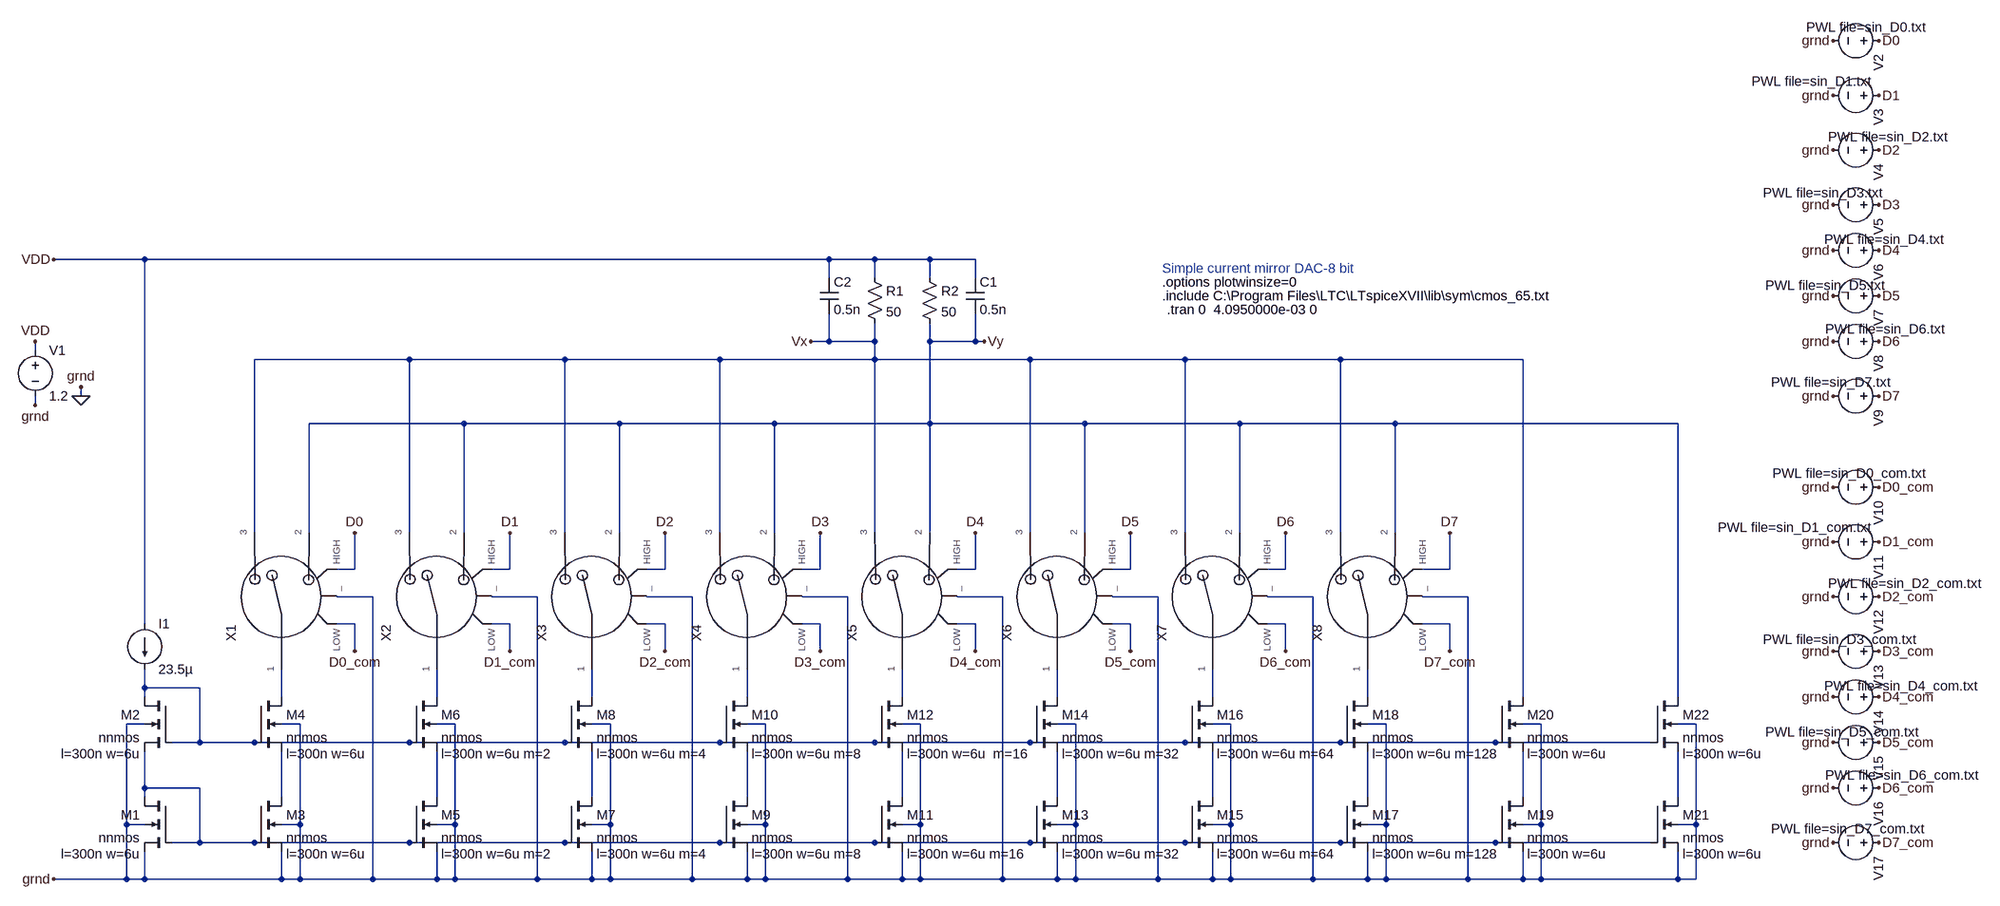
[diagram p0: schematic dac_simple.asc]
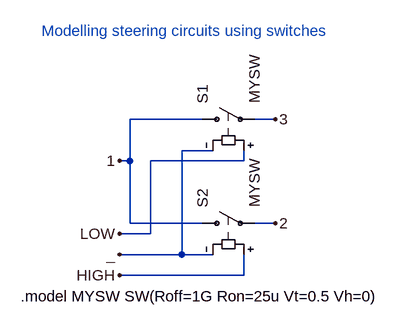
[diagram p1: sub-circuit myspdt.asc]
dac_simple.asc, the LTspice schematic file:
Version 4
SHEET 1 2736 888
WIRE -688 -304 -848 -304
WIRE 512 -304 -688 -304
WIRE 592 -304 512 -304
WIRE 688 -304 592 -304
WIRE 768 -304 688 -304
WIRE 512 -272 512 -304
WIRE 592 -272 592 -304
WIRE 688 -272 688 -304
WIRE 768 -272 768 -304
WIRE 512 -160 512 -208
WIRE 512 -160 480 -160
WIRE 592 -160 592 -192
WIRE 592 -160 512 -160
WIRE 688 -160 688 -192
WIRE 768 -160 768 -208
WIRE 768 -160 688 -160
WIRE 784 -160 768 -160
WIRE -880 -144 -880 -160
WIRE -224 -128 -496 -128
WIRE 48 -128 -224 -128
WIRE 320 -128 48 -128
WIRE 592 -128 592 -160
WIRE 592 -128 320 -128
WIRE 864 -128 592 -128
WIRE 1136 -128 864 -128
WIRE 1408 -128 1136 -128
WIRE 1728 -128 1408 -128
WIRE -800 -64 -800 -80
WIRE -880 -48 -880 -64
WIRE -128 -16 -400 -16
WIRE 144 -16 -128 -16
WIRE 416 -16 144 -16
WIRE 688 -16 688 -160
WIRE 688 -16 416 -16
WIRE 960 -16 688 -16
WIRE 1232 -16 960 -16
WIRE 1504 -16 1232 -16
WIRE 2000 -16 1504 -16
WIRE -496 176 -496 -128
WIRE -400 176 -400 -16
WIRE -224 176 -224 -128
WIRE -128 176 -128 -16
WIRE 48 176 48 -128
WIRE 144 176 144 -16
WIRE 320 176 320 -128
WIRE 416 176 416 -16
WIRE 592 176 592 -128
WIRE 688 176 688 -16
WIRE 864 176 864 -128
WIRE 960 176 960 -16
WIRE 1136 176 1136 -128
WIRE 1232 176 1232 -16
WIRE 1408 176 1408 -128
WIRE 1504 176 1504 -16
WIRE -320 240 -320 176
WIRE -320 240 -352 240
WIRE -48 240 -48 176
WIRE -48 240 -80 240
WIRE 224 240 224 176
WIRE 224 240 192 240
WIRE 496 240 496 176
WIRE 496 240 464 240
WIRE 768 240 768 176
WIRE 768 240 736 240
WIRE 1040 240 1040 176
WIRE 1040 240 1008 240
WIRE 1312 240 1312 176
WIRE 1312 240 1280 240
WIRE 1600 240 1600 176
WIRE 1600 240 1552 240
WIRE -288 288 -352 288
WIRE 0 288 -80 288
WIRE 272 288 192 288
WIRE 544 288 464 288
WIRE 816 288 736 288
WIRE 1088 288 1008 288
WIRE 1360 288 1280 288
WIRE 1632 288 1552 288
WIRE -688 336 -688 -304
WIRE -320 336 -352 336
WIRE -48 336 -80 336
WIRE 224 336 192 336
WIRE 496 336 464 336
WIRE 768 336 736 336
WIRE 1040 336 1008 336
WIRE 1312 336 1280 336
WIRE 1600 336 1552 336
WIRE -320 384 -320 336
WIRE -48 384 -48 336
WIRE 224 384 224 336
WIRE 496 384 496 336
WIRE 768 384 768 336
WIRE 1040 384 1040 336
WIRE 1312 384 1312 336
WIRE 1600 384 1600 336
WIRE -688 448 -688 416
WIRE -592 448 -688 448
WIRE -688 464 -688 448
WIRE -448 464 -448 416
WIRE -176 464 -176 416
WIRE 96 464 96 416
WIRE 368 464 368 416
WIRE 640 464 640 416
WIRE 912 464 912 416
WIRE 1184 464 1184 416
WIRE 1456 464 1456 416
WIRE 1728 464 1728 -128
WIRE 2000 464 2000 -16
WIRE -688 512 -720 512
WIRE -416 512 -448 512
WIRE -144 512 -176 512
WIRE 128 512 96 512
WIRE 400 512 368 512
WIRE 672 512 640 512
WIRE 944 512 912 512
WIRE 1216 512 1184 512
WIRE 1488 512 1456 512
WIRE 1760 512 1728 512
WIRE 2032 512 2000 512
WIRE -592 544 -592 448
WIRE -592 544 -640 544
WIRE -496 544 -592 544
WIRE -224 544 -496 544
WIRE 48 544 -224 544
WIRE 320 544 48 544
WIRE 592 544 320 544
WIRE 864 544 592 544
WIRE 1136 544 864 544
WIRE 1408 544 1136 544
WIRE 1680 544 1408 544
WIRE 1952 544 1680 544
WIRE -688 624 -688 560
WIRE -592 624 -688 624
WIRE -688 640 -688 624
WIRE -448 640 -448 560
WIRE -176 640 -176 560
WIRE 96 640 96 560
WIRE 368 640 368 560
WIRE 640 640 640 560
WIRE 912 640 912 560
WIRE 1184 640 1184 560
WIRE 1456 640 1456 560
WIRE 1728 640 1728 560
WIRE 2000 640 2000 560
WIRE -720 688 -720 512
WIRE -688 688 -720 688
WIRE -416 688 -416 512
WIRE -416 688 -448 688
WIRE -144 688 -144 512
WIRE -144 688 -176 688
WIRE 128 688 128 512
WIRE 128 688 96 688
WIRE 400 688 400 512
WIRE 400 688 368 688
WIRE 672 688 672 512
WIRE 672 688 640 688
WIRE 944 688 944 512
WIRE 944 688 912 688
WIRE 1216 688 1216 512
WIRE 1216 688 1184 688
WIRE 1488 688 1488 512
WIRE 1488 688 1456 688
WIRE 1760 688 1760 512
WIRE 1760 688 1728 688
WIRE 2032 688 2032 512
WIRE 2032 688 2000 688
WIRE -592 720 -592 624
WIRE -592 720 -640 720
WIRE -496 720 -592 720
WIRE -224 720 -496 720
WIRE 48 720 -224 720
WIRE 320 720 48 720
WIRE 592 720 320 720
WIRE 864 720 592 720
WIRE 1136 720 864 720
WIRE 1408 720 1136 720
WIRE 1680 720 1408 720
WIRE 1952 720 1680 720
WIRE -720 784 -720 688
WIRE -720 784 -848 784
WIRE -688 784 -688 736
WIRE -688 784 -720 784
WIRE -448 784 -448 736
WIRE -448 784 -688 784
WIRE -416 784 -416 688
WIRE -416 784 -448 784
WIRE -288 784 -288 288
WIRE -288 784 -416 784
WIRE -176 784 -176 736
WIRE -176 784 -288 784
WIRE -144 784 -144 688
WIRE -144 784 -176 784
WIRE 0 784 0 288
WIRE 0 784 -144 784
WIRE 96 784 96 736
WIRE 96 784 0 784
WIRE 128 784 128 688
WIRE 128 784 96 784
WIRE 272 784 272 288
WIRE 272 784 128 784
WIRE 368 784 368 736
WIRE 368 784 272 784
WIRE 400 784 400 688
WIRE 400 784 368 784
WIRE 544 784 544 288
WIRE 544 784 400 784
WIRE 640 784 640 736
WIRE 640 784 544 784
WIRE 672 784 672 688
WIRE 672 784 640 784
WIRE 816 784 816 288
WIRE 816 784 672 784
WIRE 912 784 912 736
WIRE 912 784 816 784
WIRE 944 784 944 688
WIRE 944 784 912 784
WIRE 1088 784 1088 288
WIRE 1088 784 944 784
WIRE 1184 784 1184 736
WIRE 1184 784 1088 784
WIRE 1216 784 1216 688
WIRE 1216 784 1184 784
WIRE 1360 784 1360 288
WIRE 1360 784 1216 784
WIRE 1456 784 1456 736
WIRE 1456 784 1360 784
WIRE 1488 784 1488 688
WIRE 1488 784 1456 784
WIRE 1632 784 1632 288
WIRE 1632 784 1488 784
WIRE 1728 784 1728 736
WIRE 1728 784 1632 784
WIRE 1760 784 1760 688
WIRE 1760 784 1728 784
WIRE 2000 784 2000 736
WIRE 2000 784 1760 784
WIRE 2032 784 2032 688
WIRE 2032 784 2000 784
FLAG -800 -64 0
FLAG -800 -80 grnd
FLAG -880 -48 grnd
FLAG -880 -160 VDD
FLAG -848 784 grnd
FLAG -848 -304 VDD
FLAG 2272 -688 grnd
FLAG 2272 -592 grnd
FLAG 2272 -496 grnd
FLAG 2272 -400 grnd
FLAG 2272 -320 grnd
FLAG 2272 -240 grnd
FLAG 2272 -160 grnd
FLAG 2272 -64 grnd
FLAG 2352 -688 D0
FLAG 2352 -592 D1
FLAG 2352 -496 D2
FLAG 2352 -400 D3
FLAG 2352 -320 D4
FLAG 2352 -240 D5
FLAG 2352 -160 D6
FLAG 2352 -64 D7
FLAG 2272 96 grnd
FLAG 2272 192 grnd
FLAG 2272 288 grnd
FLAG 2272 384 grnd
FLAG 2272 464 grnd
FLAG 2272 544 grnd
FLAG 2272 624 grnd
FLAG 2272 720 grnd
FLAG 2352 96 D0_com
FLAG 2352 192 D1_com
FLAG 2352 288 D2_com
FLAG 2352 384 D3_com
FLAG 2352 464 D4_com
FLAG 2352 544 D5_com
FLAG 2352 624 D6_com
FLAG 2352 720 D7_com
FLAG 480 -160 Vx
FLAG 784 -160 Vy
FLAG -320 176 D0
FLAG -48 176 D1
FLAG 224 176 D2
FLAG 496 176 D3
FLAG 1040 176 D5
FLAG 768 176 D4
FLAG 1312 176 D6
FLAG 1600 176 D7
FLAG -320 384 D0_com
FLAG -48 384 D1_com
FLAG 224 384 D2_com
FLAG 496 384 D3_com
FLAG 768 384 D4_com
FLAG 1040 384 D5_com
FLAG 1312 384 D6_com
FLAG 1600 384 D7_com
DATAFLAG -176 448 ""
DATAFLAG -176 608 ""
DATAFLAG -448 608 ""
DATAFLAG -448 448 ""
DATAFLAG 368 448 ""
DATAFLAG 368 624 ""
SYMBOL nmos4 -640 640 M0
WINDOW 123 56 100 Left 2
SYMATTR Value2 l=300n w=6u
SYMATTR InstName M1
SYMATTR Value nnmos
SYMBOL nmos4 -640 464 M0
WINDOW 123 56 100 Left 2
SYMATTR Value2 l=300n w=6u
SYMATTR InstName M2
SYMATTR Value nnmos
SYMBOL current -688 336 R0
WINDOW 123 0 0 Left 0
WINDOW 39 0 0 Left 0
SYMATTR InstName I1
SYMATTR Value 23.5µ
SYMBOL voltage -880 -160 R0
WINDOW 123 0 0 Left 0
WINDOW 39 0 0 Left 0
SYMATTR InstName V1
SYMATTR Value 1.2
SYMBOL voltage 2368 -688 R90
WINDOW 3 -24 -68 VRight 2
WINDOW 123 0 0 Left 0
WINDOW 39 0 0 Left 0
SYMATTR Value PWL file=sin_D0.txt
SYMATTR InstName V2
SYMBOL voltage 2368 -592 R90
WINDOW 3 -25 28 VRight 2
WINDOW 123 0 0 Left 0
WINDOW 39 0 0 Left 0
SYMATTR Value PWL file=sin_D1.txt
SYMATTR InstName V3
SYMBOL voltage 2368 -496 R90
WINDOW 3 -23 105 VLeft 2
WINDOW 123 0 0 Left 0
WINDOW 39 0 0 Left 0
SYMATTR Value PWL file=sin_D2.txt
SYMATTR InstName V4
SYMBOL voltage 2368 -400 R90
WINDOW 3 -21 219 VLeft 2
WINDOW 123 0 0 Left 0
WINDOW 39 0 0 Left 0
SYMATTR Value PWL file=sin_D3.txt
SYMATTR InstName V5
SYMBOL voltage 2368 -320 R90
WINDOW 3 -19 111 VLeft 2
WINDOW 123 0 0 Left 0
WINDOW 39 0 0 Left 0
SYMATTR Value PWL file=sin_D4.txt
SYMATTR InstName V6
SYMBOL voltage 2368 -240 R90
WINDOW 3 -18 215 VLeft 2
WINDOW 123 0 0 Left 0
WINDOW 39 0 0 Left 0
SYMATTR Value PWL file=sin_D5.txt
SYMATTR InstName V7
SYMBOL voltage 2368 -160 R90
WINDOW 3 -22 110 VLeft 2
WINDOW 123 0 0 Left 0
WINDOW 39 0 0 Left 0
SYMATTR Value PWL file=sin_D6.txt
SYMATTR InstName V8
SYMBOL voltage 2368 -64 R90
WINDOW 3 -24 205 VLeft 2
WINDOW 123 0 0 Left 0
WINDOW 39 0 0 Left 0
SYMATTR Value PWL file=sin_D7.txt
SYMATTR InstName V9
SYMBOL voltage 2368 96 R90
WINDOW 3 -24 -68 VRight 2
WINDOW 123 0 0 Left 0
WINDOW 39 0 0 Left 0
SYMATTR Value PWL file=sin_D0_com.txt
SYMATTR InstName V10
SYMBOL voltage 2368 192 R90
WINDOW 3 -25 28 VRight 2
WINDOW 123 0 0 Left 0
WINDOW 39 0 0 Left 0
SYMATTR Value PWL file=sin_D1_com.txt
SYMATTR InstName V11
SYMBOL voltage 2368 288 R90
WINDOW 3 -23 105 VLeft 2
WINDOW 123 0 0 Left 0
WINDOW 39 0 0 Left 0
SYMATTR Value PWL file=sin_D2_com.txt
SYMATTR InstName V12
SYMBOL voltage 2368 384 R90
WINDOW 3 -21 219 VLeft 2
WINDOW 123 0 0 Left 0
WINDOW 39 0 0 Left 0
SYMATTR Value PWL file=sin_D3_com.txt
SYMATTR InstName V13
SYMBOL voltage 2368 464 R90
WINDOW 3 -19 111 VLeft 2
WINDOW 123 0 0 Left 0
WINDOW 39 0 0 Left 0
SYMATTR Value PWL file=sin_D4_com.txt
SYMATTR InstName V14
SYMBOL voltage 2368 544 R90
WINDOW 3 -18 215 VLeft 2
WINDOW 123 0 0 Left 0
WINDOW 39 0 0 Left 0
SYMATTR Value PWL file=sin_D5_com.txt
SYMATTR InstName V15
SYMBOL voltage 2368 624 R90
WINDOW 3 -22 110 VLeft 2
WINDOW 123 0 0 Left 0
WINDOW 39 0 0 Left 0
SYMATTR Value PWL file=sin_D6_com.txt
SYMATTR InstName V16
SYMBOL voltage 2368 720 R90
WINDOW 3 -24 205 VLeft 2
WINDOW 123 0 0 Left 0
WINDOW 39 0 0 Left 0
SYMATTR Value PWL file=sin_D7_com.txt
SYMATTR InstName V17
SYMBOL nmos4 -496 640 R0
WINDOW 123 56 100 Left 2
SYMATTR Value2 l=300n w=6u
SYMATTR InstName M3
SYMATTR Value nnmos
SYMBOL nmos4 -496 464 R0
WINDOW 123 56 100 Left 2
SYMATTR Value2 l=300n w=6u
SYMATTR InstName M4
SYMATTR Value nnmos
SYMBOL nmos4 -224 640 R0
WINDOW 123 56 100 Left 2
SYMATTR Value2 l=300n w=6u m=2
SYMATTR InstName M5
SYMATTR Value nnmos
SYMBOL nmos4 -224 464 R0
WINDOW 123 56 100 Left 2
SYMATTR Value2 l=300n w=6u m=2
SYMATTR InstName M6
SYMATTR Value nnmos
SYMBOL nmos4 48 640 R0
WINDOW 123 56 100 Left 2
SYMATTR Value2 l=300n w=6u m=4
SYMATTR InstName M7
SYMATTR Value nnmos
SYMBOL nmos4 48 464 R0
WINDOW 123 56 100 Left 2
SYMATTR Value2 l=300n w=6u m=4
SYMATTR InstName M8
SYMATTR Value nnmos
SYMBOL nmos4 320 640 R0
WINDOW 123 56 100 Left 2
SYMATTR Value2 l=300n w=6u m=8
SYMATTR InstName M9
SYMATTR Value nnmos
SYMBOL nmos4 320 464 R0
WINDOW 123 56 100 Left 2
SYMATTR Value2 l=300n w=6u m=8
SYMATTR InstName M10
SYMATTR Value nnmos
SYMBOL nmos4 592 640 R0
WINDOW 123 56 100 Left 2
SYMATTR Value2 l=300n w=6u m=16
SYMATTR InstName M11
SYMATTR Value nnmos
SYMBOL nmos4 592 464 R0
WINDOW 123 56 100 Left 2
SYMATTR Value2 l=300n w=6u  m=16
SYMATTR InstName M12
SYMATTR Value nnmos
SYMBOL nmos4 864 640 R0
WINDOW 123 56 100 Left 2
SYMATTR Value2 l=300n w=6u m=32
SYMATTR InstName M13
SYMATTR Value nnmos
SYMBOL nmos4 864 464 R0
WINDOW 123 56 100 Left 2
SYMATTR Value2 l=300n w=6u m=32
SYMATTR InstName M14
SYMATTR Value nnmos
SYMBOL nmos4 1136 640 R0
WINDOW 123 56 100 Left 2
SYMATTR Value2 l=300n w=6u m=64
SYMATTR InstName M15
SYMATTR Value nnmos
SYMBOL nmos4 1136 464 R0
WINDOW 123 56 100 Left 2
SYMATTR Value2 l=300n w=6u m=64
SYMATTR InstName M16
SYMATTR Value nnmos
SYMBOL nmos4 1408 640 R0
WINDOW 123 56 100 Left 2
SYMATTR Value2 l=300n w=6u m=128
SYMATTR InstName M17
SYMATTR Value nnmos
SYMBOL nmos4 1408 464 R0
WINDOW 123 56 100 Left 2
SYMATTR Value2 l=300n w=6u m=128
SYMATTR InstName M18
SYMATTR Value nnmos
SYMBOL nmos4 1680 640 R0
WINDOW 123 56 100 Left 2
SYMATTR Value2 l=300n w=6u
SYMATTR InstName M19
SYMATTR Value nnmos
SYMBOL nmos4 1680 464 R0
WINDOW 123 56 100 Left 2
SYMATTR Value2 l=300n w=6u
SYMATTR InstName M20
SYMATTR Value nnmos
SYMBOL nmos4 1952 640 R0
WINDOW 123 56 100 Left 2
SYMATTR Value2 l=300n w=6u
SYMATTR InstName M21
SYMATTR Value nnmos
SYMBOL nmos4 1952 464 R0
WINDOW 123 56 100 Left 2
SYMATTR Value2 l=300n w=6u
SYMATTR InstName M22
SYMATTR Value nnmos
SYMBOL myspdt -448 320 R270
SYMATTR InstName X1
SYMBOL myspdt -176 320 R270
SYMATTR InstName X2
SYMBOL myspdt 96 320 R270
SYMATTR InstName X3
SYMBOL myspdt 368 320 R270
SYMATTR InstName X4
SYMBOL myspdt 640 320 R270
SYMATTR InstName X5
SYMBOL myspdt 912 320 R270
SYMATTR InstName X6
SYMBOL myspdt 1184 320 R270
SYMATTR InstName X7
SYMBOL myspdt 1456 320 R270
SYMATTR InstName X8
SYMBOL res 576 -288 R0
SYMATTR InstName R1
SYMATTR Value 50
SYMBOL res 672 -288 R0
SYMATTR InstName R2
SYMATTR Value 50
SYMBOL cap 752 -272 R0
SYMATTR InstName C1
SYMATTR Value 0.5n
SYMBOL cap 496 -272 R0
SYMATTR InstName C2
SYMATTR Value 0.5n
TEXT 1096 -288 Left 2 ;Simple current mirror DAC-8 bit
TEXT 1096 -240 Left 2 !.include C:\\Program Files\\LTC\\LTspiceXVII\\lib\\sym\\cmos_65.txt
TEXT 1096 -264 Left 2 !.options plotwinsize=0
TEXT 1104 -216 Left 2 !.tran 0  4.0950000e-03 0

myspdt.asc, the sub-circuit schematic file:
Version 4
SHEET 1 880 680
WIRE 144 112 32 112
WIRE 256 112 224 112
WIRE 160 160 112 160
WIRE 32 176 32 112
WIRE 32 176 16 176
WIRE 208 176 208 160
WIRE 208 176 64 176
WIRE 32 272 32 176
WIRE 144 272 32 272
WIRE 256 272 224 272
WIRE 64 288 64 176
WIRE 64 288 16 288
WIRE 112 320 112 160
WIRE 112 320 16 320
WIRE 160 320 112 320
WIRE 208 352 208 320
WIRE 208 352 16 352
FLAG 16 176 1
FLAG 16 352 HIGH
FLAG 16 320 _
FLAG 256 272 2
FLAG 256 112 3
FLAG 16 288 LOW
SYMBOL sw 128 112 R270
SYMATTR InstName S1
SYMATTR Value MYSW
SYMBOL sw 128 272 R270
SYMATTR InstName S2
SYMATTR Value MYSW
TEXT -136 384 Left 2 !.model MYSW SW(Roff=1G Ron=25u Vt=0.5 Vh=0)
TEXT -104 -24 Left 2 ;Modelling steering circuits using switches

The netlist it stands for:
* dac_simple.asc
M1 N010 N010 0 0 nnmos l=300n w=6u
M2 N001 N001 N010 0 nnmos l=300n w=6u
I1 VDD N001 23.5µ
V1 VDD 0 1.2
V2 D0 0 PWL file=sin_D0.txt
V3 D1 0 PWL file=sin_D1.txt
V4 D2 0 PWL file=sin_D2.txt
V5 D3 0 PWL file=sin_D3.txt
V6 D4 0 PWL file=sin_D4.txt
V7 D5 0 PWL file=sin_D5.txt
V8 D6 0 PWL file=sin_D6.txt
V9 D7 0 PWL file=sin_D7.txt
V10 D0_com 0 PWL file=sin_D0_com.txt
V11 D1_com 0 PWL file=sin_D1_com.txt
V12 D2_com 0 PWL file=sin_D2_com.txt
V13 D3_com 0 PWL file=sin_D3_com.txt
V14 D4_com 0 PWL file=sin_D4_com.txt
V15 D5_com 0 PWL file=sin_D5_com.txt
V16 D6_com 0 PWL file=sin_D6_com.txt
V17 D7_com 0 PWL file=sin_D7_com.txt
M3 N011 N010 0 0 nnmos l=300n w=6u
M4 N002 N001 N011 0 nnmos l=300n w=6u
M5 N012 N010 0 0 nnmos l=300n w=6u m=2
M6 N003 N001 N012 0 nnmos l=300n w=6u m=2
M7 N013 N010 0 0 nnmos l=300n w=6u m=4
M8 N004 N001 N013 0 nnmos l=300n w=6u m=4
M9 N014 N010 0 0 nnmos l=300n w=6u m=8
M10 N005 N001 N014 0 nnmos l=300n w=6u m=8
M11 N015 N010 0 0 nnmos l=300n w=6u m=16
M12 N006 N001 N015 0 nnmos l=300n w=6u  m=16
M13 N016 N010 0 0 nnmos l=300n w=6u m=32
M14 N007 N001 N016 0 nnmos l=300n w=6u m=32
M15 N017 N010 0 0 nnmos l=300n w=6u m=64
M16 N008 N001 N017 0 nnmos l=300n w=6u m=64
M17 N018 N010 0 0 nnmos l=300n w=6u m=128
M18 N009 N001 N018 0 nnmos l=300n w=6u m=128
M19 N019 N010 0 0 nnmos l=300n w=6u
M20 Vx N001 N019 0 nnmos l=300n w=6u
M21 N020 N010 0 0 nnmos l=300n w=6u
M22 Vy N001 N020 0 nnmos l=300n w=6u
XX1 N002 Vy Vx D0 D0_com 0 myspdt
XX2 N003 Vy Vx D1 D1_com 0 myspdt
XX3 N004 Vy Vx D2 D2_com 0 myspdt
XX4 N005 Vy Vx D3 D3_com 0 myspdt
XX5 N006 Vy Vx D4 D4_com 0 myspdt
XX6 N007 Vy Vx D5 D5_com 0 myspdt
XX7 N008 Vy Vx D6 D6_com 0 myspdt
XX8 N009 Vy Vx D7 D7_com 0 myspdt
R1 VDD Vx 50
R2 VDD Vy 50
C1 VDD Vy 0.5n
C2 VDD Vx 0.5n

* block symbol definitions
.subckt myspdt 1 2 3 HIGH LOW _
S1 1 3 LOW _ MYSW
S2 1 2 HIGH _ MYSW
.model MYSW SW(Roff=1G Ron=25u Vt=0.5 Vh=0)
* Modelling steering circuits using switches
.ends myspdt

.model NMOS NMOS
.model PMOS PMOS
.lib standard.mos
* Simple current mirror DAC-8 bit
.include C:\Program Files\LTC\LTspiceXVII\lib\sym\cmos_65.txt
.options plotwinsize=0
.tran 0  4.0950000e-03 0
.backanno
.end